# Altium project GasDetector_v1.0.PrjPCB
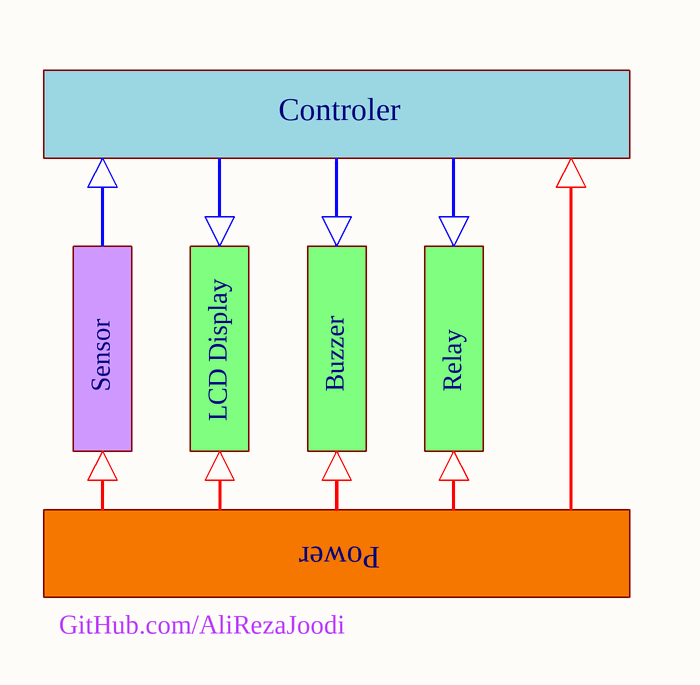
[diagram p0: Main.SchDoc]
5 sheets, 35 parts. Net scope: flat (ports and power ports of the same name join across sheets).
Board file: PCB.PcbDoc
Sheets:
  Main.SchDoc
    Power = Power.SchDoc
    Buzzer = Buzzer.SchDoc
    LCD Display = LCD Display.SchDoc
    Controler = Controler.SchDoc

## Sheet Main.SchDoc
size 58 x 55 mm

### Sub-sheets
Buzzer = Buzzer.SchDoc: no entries
Controler = Controler.SchDoc: no entries
LCD Display = LCD Display.SchDoc: no entries
Power = Power.SchDoc: no entries
Relay = Relay.SchDoc (file not in this document): no entries
Sensor = Sensor.SchDoc (file not in this document): no entries

### Notes on the sheet
- GitHub.com/AliRezaJoodi

## Sheet Power.SchDoc
size 165 x 76 mm
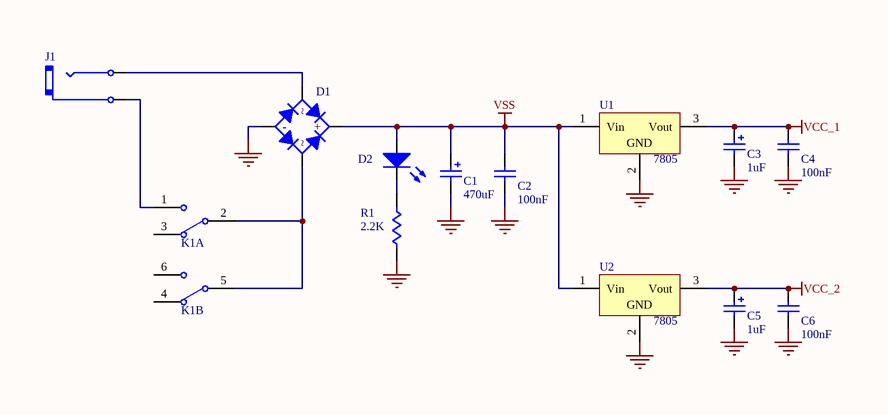
[diagram p1: Power.SchDoc]

### Parts
C1  value 470uF  [RB_3.175mm]  (hidden comment: Capacitor_1)
C2  value 100nF  [RAD_5.08MM]  (hidden comment: Capacitor_2)
C3  value 1uF  [RB_3.175mm]  (hidden comment: Capacitor_1)
C4  value 100nF  [RAD_5.08MM]  (hidden comment: Capacitor_2)
C5  value 1uF  [RB_3.175mm]  (hidden comment: Capacitor_1)
C6  value 100nF  [RAD_5.08MM]  (hidden comment: Capacitor_2)
D1  Bridge  [Bridg_2A]  (value not drawn)
D2  Optical Transmitter  [LED_5mm]  (value not drawn)
J1  Jack_Power  [Jack_Power]  (value not drawn)
K1  SW-SPDT  [KEY ON/OFF 6PIN]  (value not drawn)  (parts A,B of 2)
R1  value 2.2K  [AXIAL0.4]  (hidden comment: Resistor)
U1  value 7805  [TO257H]  (hidden comment: Volt Reg)
U2  value 7805  [TO257H]  (hidden comment: Volt Reg)

### Nets
GND: C1.2 C2.2 C3.2 C4.2 C5.2 C6.2 D1.1(-) R1.2 U1.2(GND) U2.2(GND)
VCC_1: C3.1 C4.1 U1.3(Vout)
VCC_2: C5.1 C6.1 U2.3(Vout)
VSS: C1.1 C2.1 D1.3(+) D2.1(A) U1.1(Vin) U2.1(Vin)
NetD1_2: D1.2 K1.2(COMMON) K1.5(COMMON)
NetD1_4: D1.4 J1.1(A)
NetD2_2: D2.2(K) R1.1
NetJ1_2: J1.2(B) K1.1(NO)

Not connected (* = marked no-connect by the designer): K1 3(NC) 4(NC) 6(NO)

### Library data of the parts
C1 C3 C5 = Capacitor_1: Polarized Capacitor (Radial); Manufacturer: Generic Components; Class I: Passive; Published: 8-Jun-2000; Revision: July-2002: Re-released for DXP Platform.; Publisher: Altium Limited; Class II: Capacitor
C2 C4 C6 = Capacitor_2: Polarized Capacitor (Radial); Manufacturer: Generic Components; Class I: Passive; Published: 8-Jun-2000; Revision: July-2002: Re-released for DXP Platform.; Publisher: Altium Limited; Class II: Capacitor
D1 = Bridge: Full Wave Diode Bridge; Manufacturer: Generic Components; Class I: Discrete; Class II: Rectifier - Bridge; Published: 8-Jun-2000; Revision: July-2002: Re-released for DXP Platform.; Publisher: Altium Limited
D2 = Optical Transmitter: Typical INFRARED GaAs LED; Manufacturer: Generic Components; Class I: Optoelectronic; Published: 8-Jun-2000; Revision: July-2002: Re-released for DXP Platform.; Publisher: Altium Limited; Class II: LED
J1 = Jack_Power: 2-Conductor Jack; Manufacturer: Generic Components; Class I: Connector; Revision: July-2002: Re-released for DXP Platform.; Publisher: Altium Limited
K1 = SW-SPDT: Single-Pole, Double-Throw Switch, Key; Manufacturer: Generic Components; Published: 24-Mar-1999; Revision: July-2002: Re-released for DXP Platform.; Publisher: Altium Limited
R1 = Resistor: Thermistor; Manufacturer: Generic Components; Revision: July-2002: Re-released for DXP Platform.; Publisher: Altium Limited
U1 U2 = Volt Reg: Voltage Regulator; Manufacturer: Generic Components; Class I: Power Management; Published: 24-Mar-1999; Revision: July-2002: Re-released for DXP Platform.; Publisher: Altium Limited; Class II: Voltage Regulator

## Sheet Buzzer.SchDoc
size 76 x 50 mm
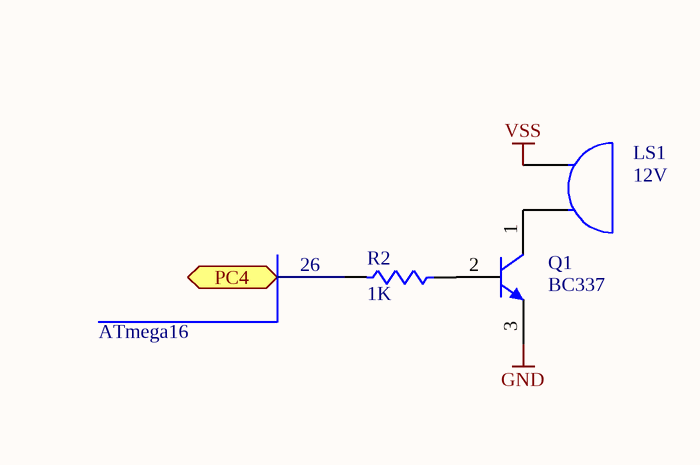
[diagram p2: Buzzer.SchDoc]

### Parts
LS1  value 12V  [RB_7.62mm]  (hidden comment: Buzzer)
Q1  Device: BC337  [TO92C]  (hidden comment: NPN)
R2  value 1K  [AXIAL0.4]  (hidden comment: Resistor)

### Ports
PC4

### Nets
GND: Q1.3(E)
VSS: LS1.1(A)
NetLS1_2: LS1.2(B) Q1.1(C)
NetQ1_2: Q1.2(B) R2.1
NetR2_2: R2.2 ; port PC4

### Notes on the sheet
- (near R2) 26
- ATmega16

### Library data of the parts
LS1 = Buzzer: Sounder; Manufacturer: Generic Components; Published: 24-Mar-1999; Revision: July-2002: Re-released for DXP Platform.; Publisher: Altium Limited
Q1 = NPN: Silicon Bipolar Transistor; Package Reference: TO-92A
R2 = Resistor: Manufacturer: Generic Components; Revision: July-2002: Re-released for DXP Platform.; Publisher: Altium Limited

## Sheet LCD Display.SchDoc
size 127 x 101 mm; PageSetup: Record=PageOptions|CenterHorizontal=True|CenterVertical=True|PrintScale=0.75|XCorrection=1.00|YCorrection=1.00|PrintKind=2|BorderSize=5000000|LeftOffset=0|BottomOffset=0|Orientation=2|PaperLength=1000|PaperWidth=1000|Scale=100|PaperSource=7|PrintQuality=-3|MediaType=1|DitherType=10|PrintScaleMode=1|PaperKind=A4|PaperIndex=9
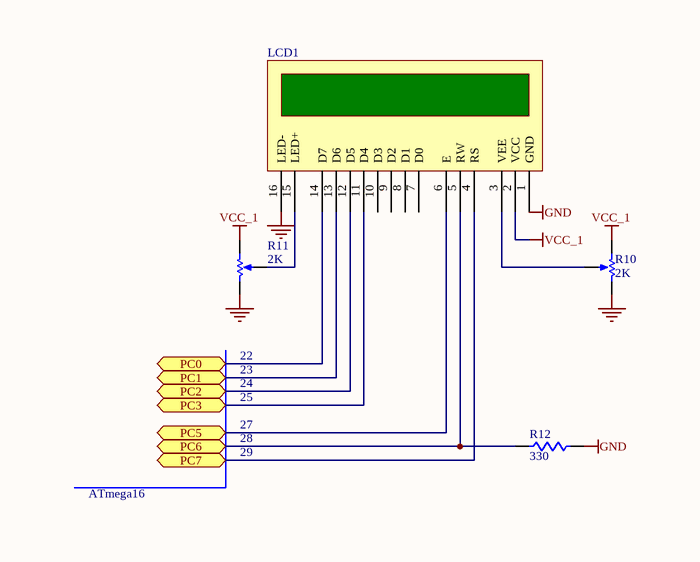
[diagram p3: LCD Display.SchDoc]

### Parts
LCD1  LCD_16*2  [LCD_2x16]  (value not drawn)
R10  value 2K  [VR8-5/5.6MM]  (hidden comment: RPot1)
R11  value 2K  [VR8-5/5.6MM]  (hidden comment: RPot1)
R12  value 330  [AXIAL0.4]  (hidden comment: Resistor)

### Ports
PC0, PC1, PC2, PC3, PC5, PC6, PC7

### Nets
GND: LCD1.1(GND) LCD1.16(LED-) R10.1(TOP) R11.2(BOT) R12.1
VCC_1: LCD1.2(VCC) R10.2(BOT) R11.1(TOP)
NetLCD1_3: LCD1.3(VEE) R10.3(TAP)
NetLCD1_4: LCD1.4(RS) ; port PC7
NetLCD1_5: LCD1.5(RW) R12.2 ; port PC6
NetLCD1_6: LCD1.6(E) ; port PC5
NetLCD1_11: LCD1.11(D4) ; port PC3
NetLCD1_12: LCD1.12(D5) ; port PC2
NetLCD1_13: LCD1.13(D6) ; port PC1
NetLCD1_14: LCD1.14(D7) ; port PC0
NetLCD1_15: LCD1.15(LED+) R11.3(TAP)

Not connected (* = marked no-connect by the designer): LCD1 7(D0) 8(D1) 9(D2) 10(D3)

### Notes on the sheet
- 22
- 23
- 24
- 25
- 27
- 28
- ATmega16
- 29

### Library data of the parts
R10 R11 = RPot1: Potentiometer; Manufacturer: Generic Components; Class I: Passive; Set Position: 0.5; Published: 8-Jun-2000; Revision: July-2002: Re-released for DXP Platform.; Publisher: Altium Limited; Class II: Potentiometer
R12 = Resistor: Manufacturer: Generic Components; Revision: July-2002: Re-released for DXP Platform.; Publisher: Altium Limited

## Sheet Controler.SchDoc
size 203 x 177 mm
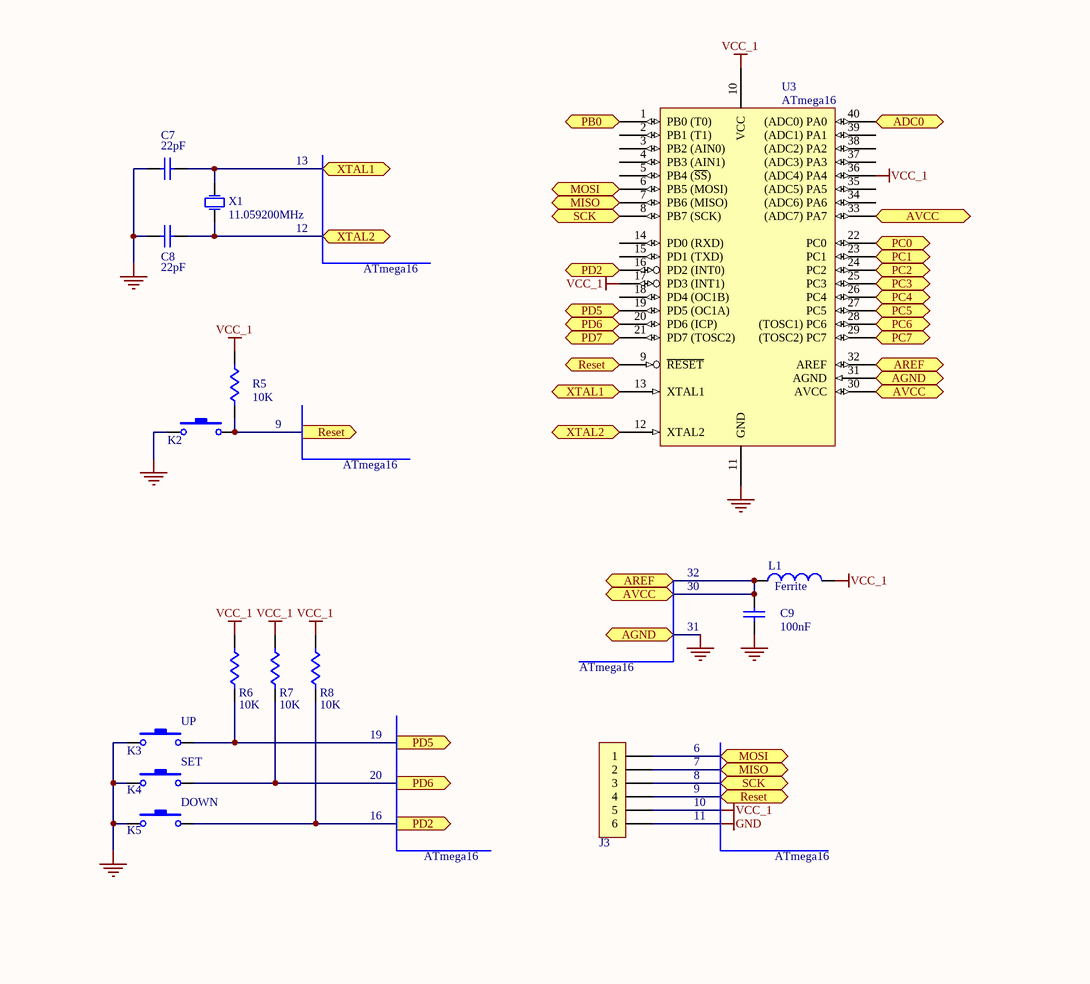
[diagram p4: Controler.SchDoc]

### Parts
C7  value 22pF  [RAD_5.08MM]  (hidden comment: Capacitor_2)
C8  value 22pF  [RAD_5.08MM]  (hidden comment: Capacitor_2)
C9  value 100nF  [RAD_5.08MM]  (hidden comment: Capacitor_2)
J3  Connector_6pin  [HDR1X6]  (value not drawn)
K2  SW-PB  [SPST-2]  (value not drawn)
K3  SW-PB  [SPST-2]  (value not drawn)
K4  SW-PB  [SPST-2]  (value not drawn)
K5  SW-PB  [SPST-2]  (value not drawn)
L1  Ferrite  [Inductor_1]
R5  value 10K  [AXIAL0.4]  (hidden comment: Resistor)
R6  value 10K  [AXIAL0.4]  (hidden comment: Resistor)
R7  value 10K  [AXIAL0.4]  (hidden comment: Resistor)
R8  value 10K  [AXIAL0.4]  (hidden comment: Resistor)
U3  Device: ATmega16  [DIP-40]  (hidden comment: ATmega16_DIP40)
X1  value 11.059200MHz  [XTAL_1]  (hidden comment: XTAL)

### Ports
ADC0, AGND, AREF, AVCC, MISO, MOSI, PB0, PC0, PC1, PC2, PC3, PC4, PC5, PC6, PC7, PD2, PD2 (out), PD5, PD5 (out), PD6, PD6 (out), PD7, Reset, Reset (out), SCK, XTAL1, XTAL2

### Nets
GND: C7.1 C8.1 C9.1 J3.6 K2.1 K3.1 K4.1 K5.1 U3.11(GND) U3.31(AGND) ; port AGND
VCC_1: J3.5 L1.2 R5.1 R6.1 R7.1 R8.1 U3.10(VCC) U3.17(PD3_(INT1)) U3.36((ADC4)_PA4)
NetC7_2: C7.2 U3.13(XTAL1) X1.2(OSC2) ; port XTAL1
NetC8_2: C8.2 U3.12(XTAL2) X1.1(OSC1) ; port XTAL2
NetC9_2: C9.2 L1.1 U3.30(AVCC) U3.32(AREF) U3.33((ADC7)_PA7) ; port AREF, port AVCC
NetJ3_1: J3.1 U3.6(PB5_(MOSI)) ; port MOSI
NetJ3_2: J3.2 U3.7(PB6_(MISO)) ; port MISO
NetJ3_3: J3.3 U3.8(PB7_(SCK)) ; port SCK
NetJ3_4: J3.4 K2.2 R5.2 U3.9(~{RESET}) ; port Reset
NetK3_2: K3.2 R6.2 U3.19(PD5_(OC1A)) ; port PD5
NetK4_2: K4.2 R7.2 U3.20(PD6_(ICP)) ; port PD6
NetK5_2: K5.2 R8.2 U3.16(PD2_(INT0)) ; port PD2
NetLCD1_4: U3.29((TOSC2)_PC7) ; port PC7
NetLCD1_5: U3.28((TOSC1)_PC6) ; port PC6
NetLCD1_6: U3.27(PC5) ; port PC5
NetLCD1_11: U3.25(PC3) ; port PC3
NetLCD1_12: U3.24(PC2) ; port PC2
NetLCD1_13: U3.23(PC1) ; port PC1
NetLCD1_14: U3.22(PC0) ; port PC0
NetR2_2: U3.26(PC4) ; port PC4
NetU3_1: U3.1(PB0_(T0)) ; port PB0
NetU3_21: U3.21(PD7_(TOSC2)) ; port PD7
NetU3_40: U3.40((ADC0)_PA0) ; port ADC0

Not connected (* = marked no-connect by the designer): U3 2(PB1_(T1)) 3(PB2_(AIN0)) 4(PB3_(AIN1)) 5(PB4_(~{SS})) 14(PD0_(RXD)) 15(PD1_(TXD)) 18(PD4_(OC1B)) 34((ADC6)_PA6) 35((ADC5)_PA5) 37((ADC3)_PA3) 38((ADC2)_PA2) 39((ADC1)_PA1)

### Notes on the sheet
- 13
- 12
- ATmega16
- 9
- 32
- 30
- 31
- (near K3) UP
- 19
- SET
- 20
- 6
- 7
- 8
- DOWN
- 16
- 10
- 11

### Library data of the parts
C7-C9 = Capacitor_2: Capacitor; Manufacturer: Generic Components; Class I: Passive; Published: 8-Jun-2000; Revision: July-2002: Re-released for DXP Platform.; Publisher: Altium Limited; Class II: Capacitor
J3 = Connector_6pin: Header, 6-Pin; Manufacturer: Generic Components; Revision: July-2002: Re-released for DXP Platform.; Publisher: Altium Limited; Class I: Connector
K2 = SW-PB: Switch; Manufacturer: Generic Components; Published: 24-Mar-1999; Revision: July-2002: Re-released for DXP Platform.; Publisher: Altium Limited
K3-K5 = SW-PB: Switch, Key; Manufacturer: Generic Components; Published: 24-Mar-1999; Revision: July-2002: Re-released for DXP Platform.; Publisher: Altium Limited
L1 = Inductor: Manufacturer: Generic Components; Class I: Passive; Published: 8-Jun-2000; Revision: July-2002: Re-released for DXP Platform.; Publisher: Altium Limited; Class II: Ferrite
R5-R8 = Resistor: Manufacturer: Generic Components; Revision: July-2002: Re-released for DXP Platform.; Publisher: Altium Limited
U3 = ATmega16_DIP40: Atmel Microcontroller - Library created by carel..  <www.mpfreezone.com>
X1 = XTAL: Crystal Oscillator; Manufacturer: Generic Components; Published: 8-Jun-2000; Revision: July-2002: Re-released for DXP Platform.; Publisher: Altium Limited; Class I: Oscillator; Class II: Crystal Oscillator

## Nets that join several sheets
GND: Power (10 pins), Buzzer (Q1.3), LCD Display (5 pins), Controler (10 pins)
VCC_1: Power (C3.1 C4.1 U1.3), LCD Display (LCD1.2 R10.2 R11.1), Controler (9 pins)
VSS: Power (6 pins), Buzzer (LS1.1)
NetLCD1_4: LCD Display (LCD1.4), Controler (U3.29)
NetLCD1_5: LCD Display (LCD1.5 R12.2), Controler (U3.28)
NetLCD1_6: LCD Display (LCD1.6), Controler (U3.27)
NetLCD1_11: LCD Display (LCD1.11), Controler (U3.25)
NetLCD1_12: LCD Display (LCD1.12), Controler (U3.24)
NetLCD1_13: LCD Display (LCD1.13), Controler (U3.23)
NetLCD1_14: LCD Display (LCD1.14), Controler (U3.22)
NetR2_2: Buzzer (R2.2), Controler (U3.26)